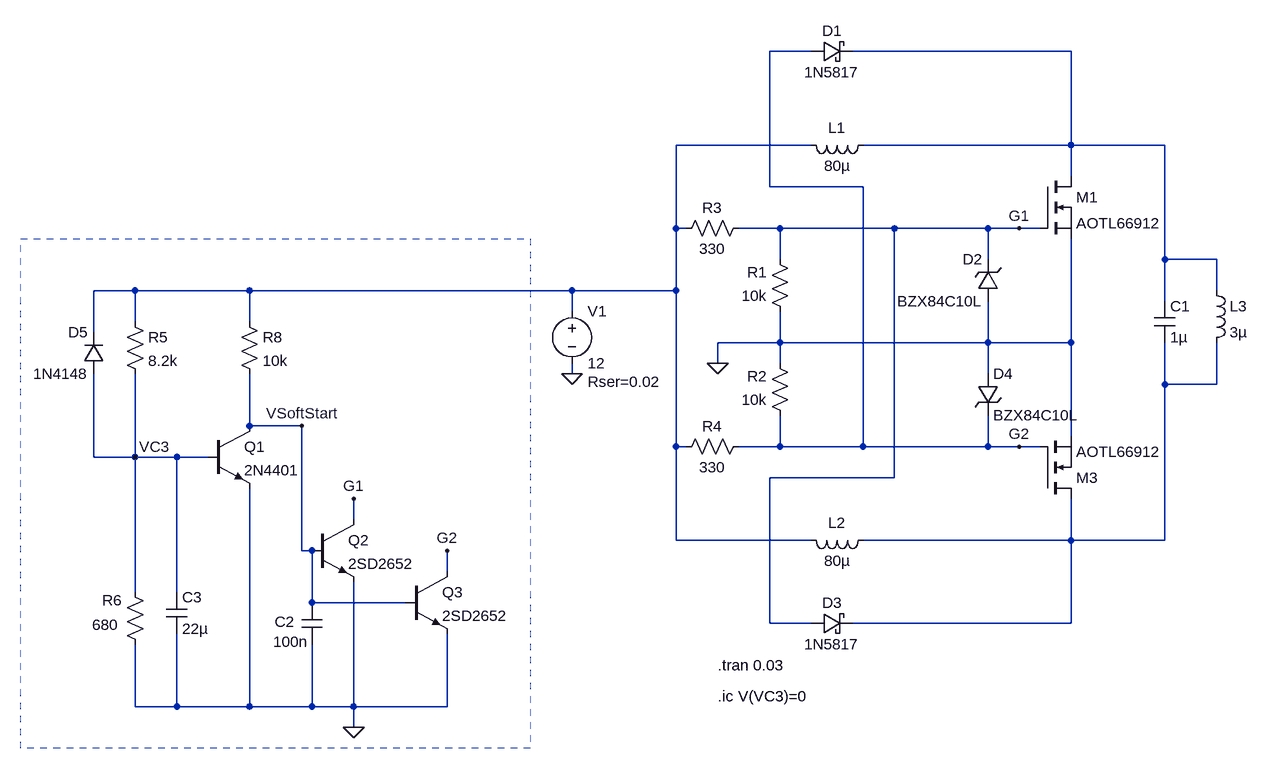
[diagram p0: schematic ZVS.asc]
ZVS.asc, the LTspice schematic file:
Version 4
SHEET 1 1220 804
WIRE 352 -272 288 -272
WIRE 752 -272 416 -272
WIRE 352 -128 144 -128
WIRE 752 -128 752 -272
WIRE 752 -128 432 -128
WIRE 896 -128 752 -128
WIRE 752 -80 752 -128
WIRE 288 -64 288 -272
WIRE 432 -64 288 -64
WIRE 144 0 144 -128
WIRE 160 0 144 0
WIRE 304 0 240 0
WIRE 480 0 304 0
WIRE 624 0 480 0
WIRE 672 0 624 0
WIRE 704 0 672 0
WIRE 304 48 304 0
WIRE 624 48 624 0
WIRE 896 48 896 -128
WIRE 976 48 896 48
WIRE -688 96 -752 96
WIRE -512 96 -688 96
WIRE -16 96 -512 96
WIRE 144 96 144 0
WIRE 144 96 -16 96
WIRE 976 96 976 48
WIRE 896 112 896 48
WIRE -16 128 -16 96
WIRE -688 144 -688 96
WIRE -512 144 -512 96
WIRE -752 160 -752 96
WIRE 304 176 304 128
WIRE 304 176 208 176
WIRE 624 176 624 112
WIRE 624 176 304 176
WIRE 752 176 752 16
WIRE 752 176 624 176
WIRE 208 208 208 176
WIRE 304 208 304 176
WIRE -16 224 -16 208
WIRE 624 224 624 176
WIRE 896 240 896 176
WIRE 976 240 976 176
WIRE 976 240 896 240
WIRE -512 304 -512 224
WIRE -432 304 -512 304
WIRE 752 320 752 176
WIRE 144 336 144 96
WIRE 160 336 144 336
WIRE 304 336 304 288
WIRE 304 336 240 336
WIRE 432 336 432 -64
WIRE 432 336 304 336
WIRE 624 336 624 288
WIRE 624 336 432 336
WIRE 672 336 624 336
WIRE 704 336 672 336
WIRE -752 352 -752 224
WIRE -688 352 -688 224
WIRE -688 352 -752 352
WIRE -624 352 -688 352
WIRE -576 352 -624 352
WIRE 480 384 480 0
WIRE 480 384 288 384
WIRE -352 448 -352 416
WIRE 144 480 144 336
WIRE 352 480 144 480
WIRE 752 480 752 416
WIRE 752 480 432 480
WIRE 896 480 896 240
WIRE 896 480 752 480
WIRE -432 496 -432 304
WIRE -416 496 -432 496
WIRE -208 528 -208 496
WIRE -688 560 -688 352
WIRE -624 560 -624 352
WIRE -416 576 -416 496
WIRE -272 576 -416 576
WIRE 288 608 288 384
WIRE 352 608 288 608
WIRE 752 608 752 480
WIRE 752 608 416 608
WIRE -688 736 -688 640
WIRE -624 736 -624 624
WIRE -624 736 -688 736
WIRE -512 736 -512 400
WIRE -512 736 -624 736
WIRE -416 736 -416 640
WIRE -416 736 -512 736
WIRE -352 736 -352 544
WIRE -352 736 -416 736
WIRE -208 736 -208 624
WIRE -208 736 -352 736
WIRE -352 768 -352 736
FLAG -16 224 0
FLAG 208 208 0
FLAG 672 0 G1
FLAG 672 336 G2
FLAG -208 496 G2
FLAG -352 416 G1
FLAG -352 768 0
FLAG -688 352 VC3
FLAG -432 304 VSoftStart
SYMBOL voltage -16 112 R0
WINDOW 123 0 0 Left 0
WINDOW 39 24 124 Left 2
SYMATTR SpiceLine Rser=0.02
SYMATTR InstName V1
SYMATTR Value 12
SYMBOL res 320 144 R180
WINDOW 0 36 76 Left 2
WINDOW 3 36 40 Left 2
SYMATTR InstName R1
SYMATTR Value 10k
SYMBOL res 320 304 R180
WINDOW 0 36 76 Left 2
WINDOW 3 36 40 Left 2
SYMATTR InstName R2
SYMATTR Value 10k
SYMBOL res 144 16 R270
WINDOW 0 32 56 VTop 2
WINDOW 3 0 56 VBottom 2
SYMATTR InstName R3
SYMATTR Value 330
SYMBOL res 144 352 R270
WINDOW 0 32 56 VTop 2
WINDOW 3 0 56 VBottom 2
SYMATTR InstName R4
SYMATTR Value 330
SYMBOL ind 448 -144 R90
WINDOW 0 5 56 VBottom 2
WINDOW 3 32 56 VTop 2
SYMATTR InstName L1
SYMATTR Value 80µ
SYMBOL ind 448 464 R90
WINDOW 0 5 56 VBottom 2
WINDOW 3 32 56 VTop 2
SYMATTR InstName L2
SYMATTR Value 80µ
SYMBOL ind 960 80 R0
SYMATTR InstName L3
SYMATTR Value 3µ
SYMBOL cap 880 112 R0
SYMATTR InstName C1
SYMATTR Value 1µ
SYMBOL schottky 352 -256 R270
WINDOW 0 32 32 VTop 2
WINDOW 3 0 32 VBottom 2
SYMATTR InstName D1
SYMATTR Value 1N5817
SYMATTR Description Diode
SYMATTR Type diode
SYMBOL nmos 704 -80 R0
SYMATTR InstName M1
SYMATTR Value AOTL66912
SYMBOL schottky 352 624 R270
WINDOW 0 32 32 VTop 2
WINDOW 3 0 32 VBottom 2
SYMATTR InstName D3
SYMATTR Value 1N5817
SYMATTR Description Diode
SYMATTR Type diode
SYMBOL nmos 704 416 M180
SYMATTR InstName M3
SYMATTR Value AOTL66912
SYMBOL zener 640 112 R180
WINDOW 0 24 64 Left 2
WINDOW 3 24 0 Left 2
SYMATTR InstName D2
SYMATTR Value BZX84C10L
SYMATTR Description Diode
SYMATTR Type diode
SYMBOL zener 608 224 R0
SYMATTR InstName D4
SYMATTR Value BZX84C10L
SYMATTR Description Diode
SYMATTR Type diode
SYMBOL res -704 128 R0
SYMATTR InstName R5
SYMATTR Value 8.2k
SYMBOL res -704 544 R0
WINDOW 0 -35 28 Left 2
WINDOW 3 -50 66 Left 2
SYMATTR InstName R6
SYMATTR Value 680
SYMBOL npn -416 448 R0
SYMATTR InstName Q2
SYMATTR Value 2SD2652
SYMBOL cap -640 560 R0
SYMATTR InstName C3
SYMATTR Value 22µ
SYMBOL npn -576 304 R0
SYMATTR InstName Q1
SYMATTR Value 2N4401
SYMBOL res -528 128 R0
SYMATTR InstName R8
SYMATTR Value 10k
SYMBOL npn -272 528 R0
SYMATTR InstName Q3
SYMATTR Value 2SD2652
SYMBOL diode -736 224 R180
WINDOW 0 24 64 Left 2
WINDOW 3 24 0 Left 2
SYMATTR InstName D5
SYMATTR Value 1N4148
SYMBOL cap -432 576 R0
WINDOW 0 -41 29 Left 2
WINDOW 3 -44 60 Left 2
SYMATTR InstName C2
SYMATTR Value 100n
TEXT 208 672 Left 2 !.tran 0.03
TEXT 208 720 Left 2 !.ic V(VC3)=0
RECTANGLE Normal -80 800 -864 16 2

The netlist it stands for:
* ZVS.asc
V1 N002 0 12 Rser=0.02
R1 0 G1 10k
R2 G2 0 10k
R3 N002 G1 330
R4 N002 G2 330
L1 N001 N002 80µ
L2 N003 N002 80µ
L3 N001 N003 3µ
C1 N001 N003 1µ
D1 G2 N001 1N5817
M1 N001 G1 0 0 AOTL66912
D3 G1 N003 1N5817
M3 N003 G2 0 0 AOTL66912
D2 0 G1 BZX84C10L
D4 0 G2 BZX84C10L
R5 N002 VC3 8.2k
R6 VC3 0 680
Q2 G1 VSoftStart 0 0 2SD2652
C3 VC3 0 22µ
Q1 VSoftStart VC3 0 0 2N4401
R8 N002 VSoftStart 10k
Q3 G2 VSoftStart 0 0 2SD2652
D5 VC3 N002 1N4148
C2 VSoftStart 0 100n
.model D D
.lib standard.dio
.model NPN NPN
.model PNP PNP
.lib standard.bjt
.model NMOS NMOS
.model PMOS PMOS
.lib standard.mos
.tran 0.03
.ic V(VC3)=0
.backanno
.end